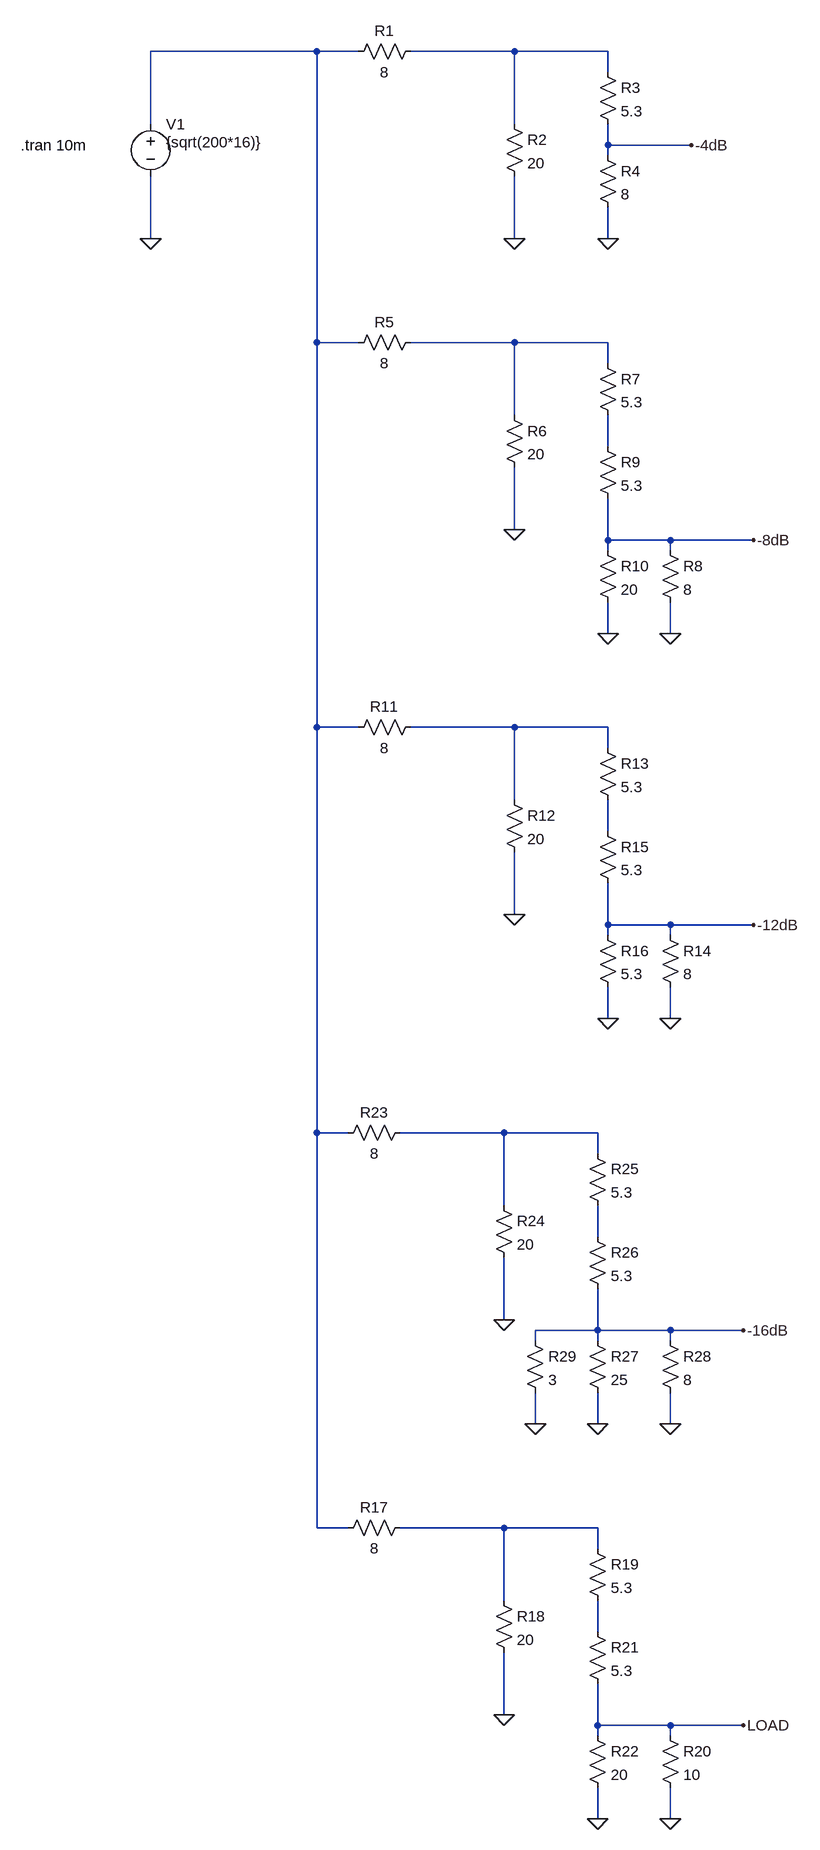
[diagram p0: schematic THD Hot Plate 8ohm.asc]
THD Hot Plate 8ohm.asc, the LTspice schematic file:
Version 4.1
SHEET 1 1128 2788
WIRE 368 -64 112 -64
WIRE 432 -64 368 -64
WIRE 672 -64 512 -64
WIRE 816 -64 672 -64
WIRE 816 -32 816 -64
WIRE 112 48 112 -64
WIRE 672 48 672 -64
WIRE 816 80 816 48
WIRE 944 80 816 80
WIRE 816 96 816 80
WIRE 112 224 112 128
WIRE 672 224 672 128
WIRE 816 224 816 176
WIRE 368 384 368 -64
WIRE 432 384 368 384
WIRE 672 384 512 384
WIRE 816 384 672 384
WIRE 816 416 816 384
WIRE 672 496 672 384
WIRE 816 544 816 496
WIRE 672 672 672 576
WIRE 816 688 816 624
WIRE 912 688 816 688
WIRE 1040 688 912 688
WIRE 816 704 816 688
WIRE 912 704 912 688
WIRE 816 832 816 784
WIRE 912 832 912 784
WIRE 368 976 368 384
WIRE 432 976 368 976
WIRE 672 976 512 976
WIRE 816 976 672 976
WIRE 816 1008 816 976
WIRE 672 1088 672 976
WIRE 816 1136 816 1088
WIRE 672 1264 672 1168
WIRE 816 1280 816 1216
WIRE 912 1280 816 1280
WIRE 1040 1280 912 1280
WIRE 816 1296 816 1280
WIRE 912 1296 912 1280
WIRE 816 1424 816 1376
WIRE 912 1424 912 1376
WIRE 368 1600 368 976
WIRE 416 1600 368 1600
WIRE 656 1600 496 1600
WIRE 800 1600 656 1600
WIRE 800 1632 800 1600
WIRE 656 1712 656 1600
WIRE 800 1760 800 1712
WIRE 656 1888 656 1792
WIRE 800 1904 800 1840
WIRE 800 1904 704 1904
WIRE 912 1904 800 1904
WIRE 1024 1904 912 1904
WIRE 704 1920 704 1904
WIRE 800 1920 800 1904
WIRE 912 1920 912 1904
WIRE 704 2048 704 2000
WIRE 800 2048 800 2000
WIRE 912 2048 912 2000
WIRE 368 2208 368 1600
WIRE 416 2208 368 2208
WIRE 656 2208 496 2208
WIRE 800 2208 656 2208
WIRE 800 2240 800 2208
WIRE 656 2320 656 2208
WIRE 800 2368 800 2320
WIRE 656 2496 656 2400
WIRE 800 2512 800 2448
WIRE 912 2512 800 2512
WIRE 1024 2512 912 2512
WIRE 800 2528 800 2512
WIRE 912 2528 912 2512
WIRE 800 2656 800 2608
WIRE 912 2656 912 2608
FLAG 112 224 0
FLAG 816 224 0
FLAG 672 224 0
FLAG 944 80 -4dB
FLAG 912 832 0
FLAG 672 672 0
FLAG 1040 688 -8dB
FLAG 816 832 0
FLAG 912 1424 0
FLAG 672 1264 0
FLAG 1040 1280 -12dB
FLAG 816 1424 0
FLAG 656 2496 0
FLAG 1024 2512 LOAD
FLAG 800 2656 0
FLAG 912 2656 0
FLAG 656 1888 0
FLAG 1024 1904 -16dB
FLAG 800 2048 0
FLAG 912 2048 0
FLAG 704 2048 0
SYMBOL voltage 112 32 R0
WINDOW 3 24 44 Left 2
WINDOW 123 0 0 Left 0
WINDOW 39 0 0 Left 0
SYMATTR Value {sqrt(200*16)}
SYMATTR InstName V1
SYMBOL res 528 -80 R90
WINDOW 0 0 56 VBottom 2
WINDOW 3 32 56 VTop 2
SYMATTR InstName R1
SYMATTR Value 8
SYMBOL res 656 32 R0
SYMATTR InstName R2
SYMATTR Value 20
SYMBOL res 800 -48 R0
SYMATTR InstName R3
SYMATTR Value 5.3
SYMBOL res 800 80 R0
SYMATTR InstName R4
SYMATTR Value 8
SYMBOL res 528 368 R90
WINDOW 0 0 56 VBottom 2
WINDOW 3 32 56 VTop 2
SYMATTR InstName R5
SYMATTR Value 8
SYMBOL res 656 480 R0
SYMATTR InstName R6
SYMATTR Value 20
SYMBOL res 800 400 R0
SYMATTR InstName R7
SYMATTR Value 5.3
SYMBOL res 896 688 R0
SYMATTR InstName R8
SYMATTR Value 8
SYMBOL res 800 528 R0
SYMATTR InstName R9
SYMATTR Value 5.3
SYMBOL res 800 688 R0
SYMATTR InstName R10
SYMATTR Value 20
SYMBOL res 528 960 R90
WINDOW 0 0 56 VBottom 2
WINDOW 3 32 56 VTop 2
SYMATTR InstName R11
SYMATTR Value 8
SYMBOL res 656 1072 R0
SYMATTR InstName R12
SYMATTR Value 20
SYMBOL res 800 992 R0
SYMATTR InstName R13
SYMATTR Value 5.3
SYMBOL res 896 1280 R0
SYMATTR InstName R14
SYMATTR Value 8
SYMBOL res 800 1120 R0
SYMATTR InstName R15
SYMATTR Value 5.3
SYMBOL res 800 1280 R0
SYMATTR InstName R16
SYMATTR Value 5.3
SYMBOL res 512 2192 R90
WINDOW 0 0 56 VBottom 2
WINDOW 3 32 56 VTop 2
SYMATTR InstName R17
SYMATTR Value 8
SYMBOL res 640 2304 R0
SYMATTR InstName R18
SYMATTR Value 20
SYMBOL res 784 2224 R0
SYMATTR InstName R19
SYMATTR Value 5.3
SYMBOL res 784 2352 R0
SYMATTR InstName R21
SYMATTR Value 5.3
SYMBOL res 784 2512 R0
SYMATTR InstName R22
SYMATTR Value 20
SYMBOL res 896 2512 R0
SYMATTR InstName R20
SYMATTR Value 10
SYMBOL res 512 1584 R90
WINDOW 0 0 56 VBottom 2
WINDOW 3 32 56 VTop 2
SYMATTR InstName R23
SYMATTR Value 8
SYMBOL res 640 1696 R0
SYMATTR InstName R24
SYMATTR Value 20
SYMBOL res 784 1616 R0
SYMATTR InstName R25
SYMATTR Value 5.3
SYMBOL res 784 1744 R0
SYMATTR InstName R26
SYMATTR Value 5.3
SYMBOL res 784 1904 R0
SYMATTR InstName R27
SYMATTR Value 25
SYMBOL res 896 1904 R0
SYMATTR InstName R28
SYMATTR Value 8
SYMBOL res 688 1904 R0
SYMATTR InstName R29
SYMATTR Value 3
TEXT -88 80 Left 2 !.tran 10m

The netlist it stands for:
* THD Hot Plate 8ohm.asc
V1 N001 0 {sqrt(200*16)}
R1 N002 N001 8
R2 N002 0 20
R3 N002 -4dB 5.3
R4 -4dB 0 8
R5 N003 N001 8
R6 N003 0 20
R7 N003 N004 5.3
R8 -8dB 0 8
R9 N004 -8dB 5.3
R10 -8dB 0 20
R11 N005 N001 8
R12 N005 0 20
R13 N005 N006 5.3
R14 -12dB 0 8
R15 N006 -12dB 5.3
R16 -12dB 0 5.3
R17 N009 N001 8
R18 N009 0 20
R19 N009 N010 5.3
R21 N010 LOAD 5.3
R22 LOAD 0 20
R20 LOAD 0 10
R23 N007 N001 8
R24 N007 0 20
R25 N007 N008 5.3
R26 N008 -16dB 5.3
R27 -16dB 0 25
R28 -16dB 0 8
R29 -16dB 0 3
.tran 10m
.backanno
.end